# EAGLE design XY_RJ12_breakout (EAGLE 7.6.0)

## Sheet 1 of 2
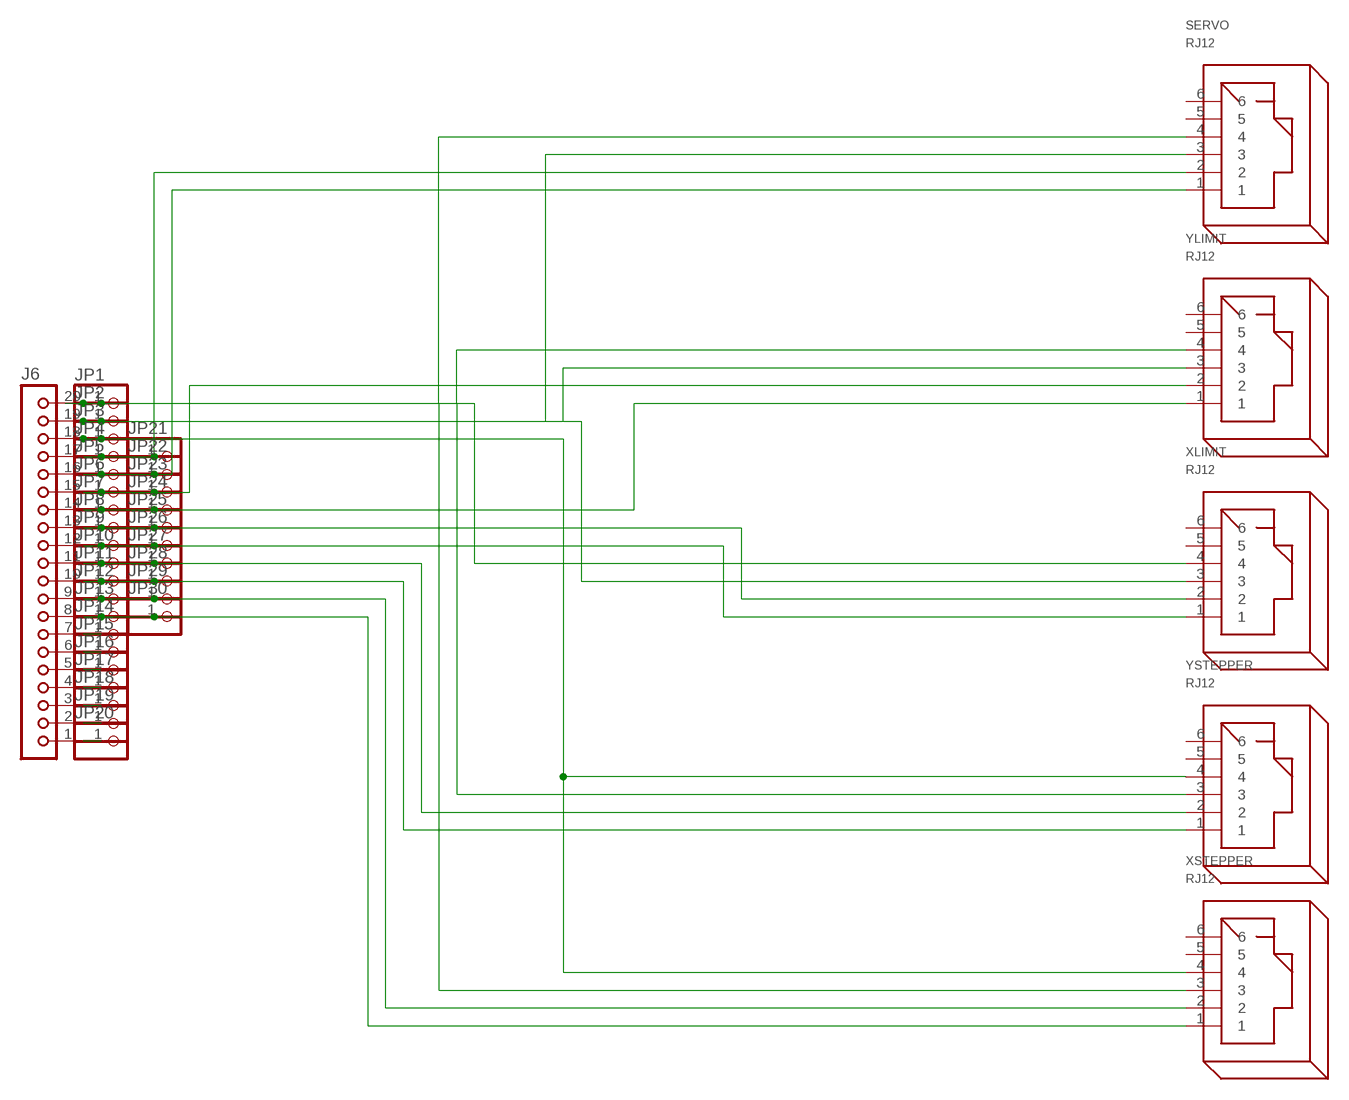
[diagram p0: schematic, sheet 1]

### Parts
J6  JBK20  [JBK20]
JP1  PINHD-1X1  [1X01]
JP2  PINHD-1X1  [1X01]
JP3  PINHD-1X1  [1X01]
JP4  PINHD-1X1  [1X01]
JP5  PINHD-1X1  [1X01]
JP6  PINHD-1X1  [1X01]
JP7  PINHD-1X1  [1X01]
JP8  PINHD-1X1  [1X01]
JP9  PINHD-1X1  [1X01]
JP10  PINHD-1X1  [1X01]
JP11  PINHD-1X1  [1X01]
JP12  PINHD-1X1  [1X01]
JP13  PINHD-1X1  [1X01]
JP14  PINHD-1X1  [1X01]
JP15  PINHD-1X1  [1X01]
JP16  PINHD-1X1  [1X01]
JP17  PINHD-1X1  [1X01]
JP18  PINHD-1X1  [1X01]
JP19  PINHD-1X1  [1X01]
JP20  PINHD-1X1  [1X01]
JP21  PINHD-1X1  [1X01]
JP22  PINHD-1X1  [1X01]
JP23  PINHD-1X1  [1X01]
JP24  PINHD-1X1  [1X01]
JP25  PINHD-1X1  [1X01]
JP26  PINHD-1X1  [1X01]
JP27  PINHD-1X1  [1X01]
JP28  PINHD-1X1  [1X01]
JP29  PINHD-1X1  [1X01]
JP30  PINHD-1X1  [1X01]
SERVO  RJ12  [RJ12]
XLIMIT  RJ12  [RJ12]
XSTEPPER  RJ12  [RJ12]
YLIMIT  RJ12  [RJ12]
YSTEPPER  RJ12  [RJ12]

### Nets
N$1: J6.20 JP1.1 SERVO.4 XLIMIT.4 XSTEPPER.3 YLIMIT.4 YSTEPPER.3
N$2: J6.19 JP2.1 SERVO.3 XLIMIT.3 YLIMIT.3
N$3: J6.18 JP3.1 XSTEPPER.4 YSTEPPER.4
N$4: J6.17 JP4.1 JP21.1 SERVO.2
N$5: J6.16 JP5.1 JP22.1 SERVO.1
N$6: J6.15 JP6.1 JP23.1 YLIMIT.2
N$7: J6.14 JP7.1 JP24.1 YLIMIT.1
N$8: J6.13 JP8.1 JP25.1 XLIMIT.2
N$9: J6.12 JP9.1 JP26.1 XLIMIT.1
N$10: J6.11 JP10.1 JP27.1 YSTEPPER.2
N$11: J6.10 JP11.1 JP28.1 YSTEPPER.1
N$12: J6.9 JP12.1 JP29.1 XSTEPPER.2
N$13: J6.8 JP13.1 JP30.1 XSTEPPER.1
N$14: J6.1 JP20.1
N$15: J6.2 JP19.1
N$16: J6.3 JP18.1
N$17: J6.4 JP17.1
N$18: J6.5 JP16.1
N$19: J6.6 JP15.1
N$20: J6.7 JP14.1
Unconnected: SERVO.5 SERVO.6 XLIMIT.5 XLIMIT.6 XSTEPPER.5 XSTEPPER.6 YLIMIT.5 YLIMIT.6 YSTEPPER.5 YSTEPPER.6

## Sheet 2 of 2

## Library data of the parts
J6 = con-lsta:JBK20: PIN HEADER; OC_FARNELL: unknown; OC_NEWARK: unknown
JP1-JP30 = pinhead:PINHD-1X1: PIN HEADER
SERVO XLIMIT XSTEPPER YLIMIT YSTEPPER = con-rj:RJ12: RJ12, RJ14 and RJ25 RJ12, RJ14 and RJ25 jacks side mounted http://www.tycoelectronics.com

## Board
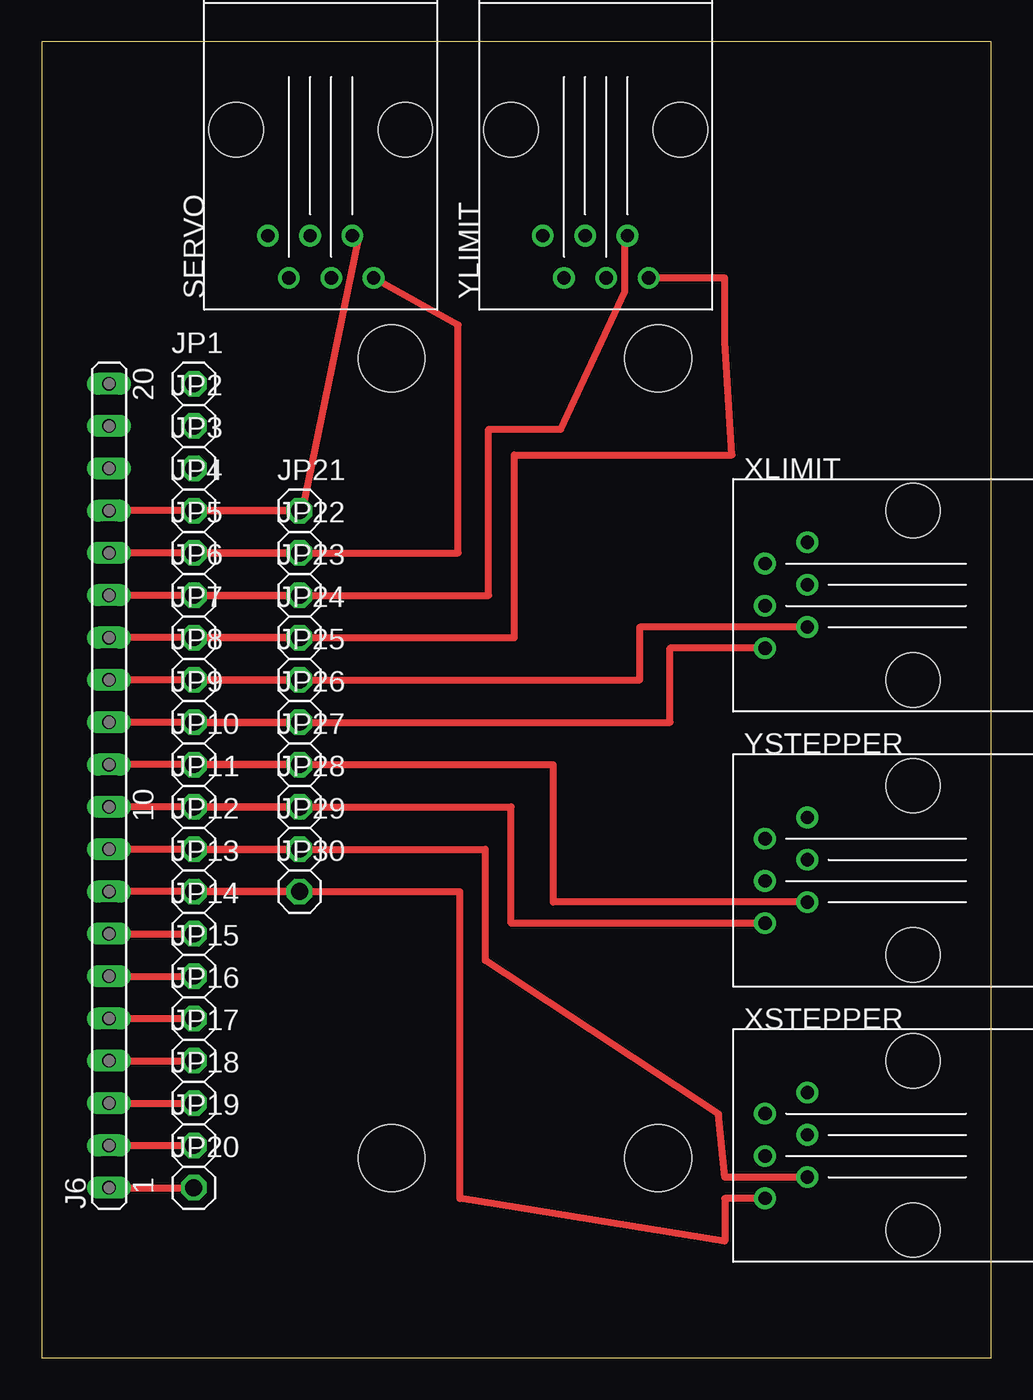
[diagram p1: board, top side]
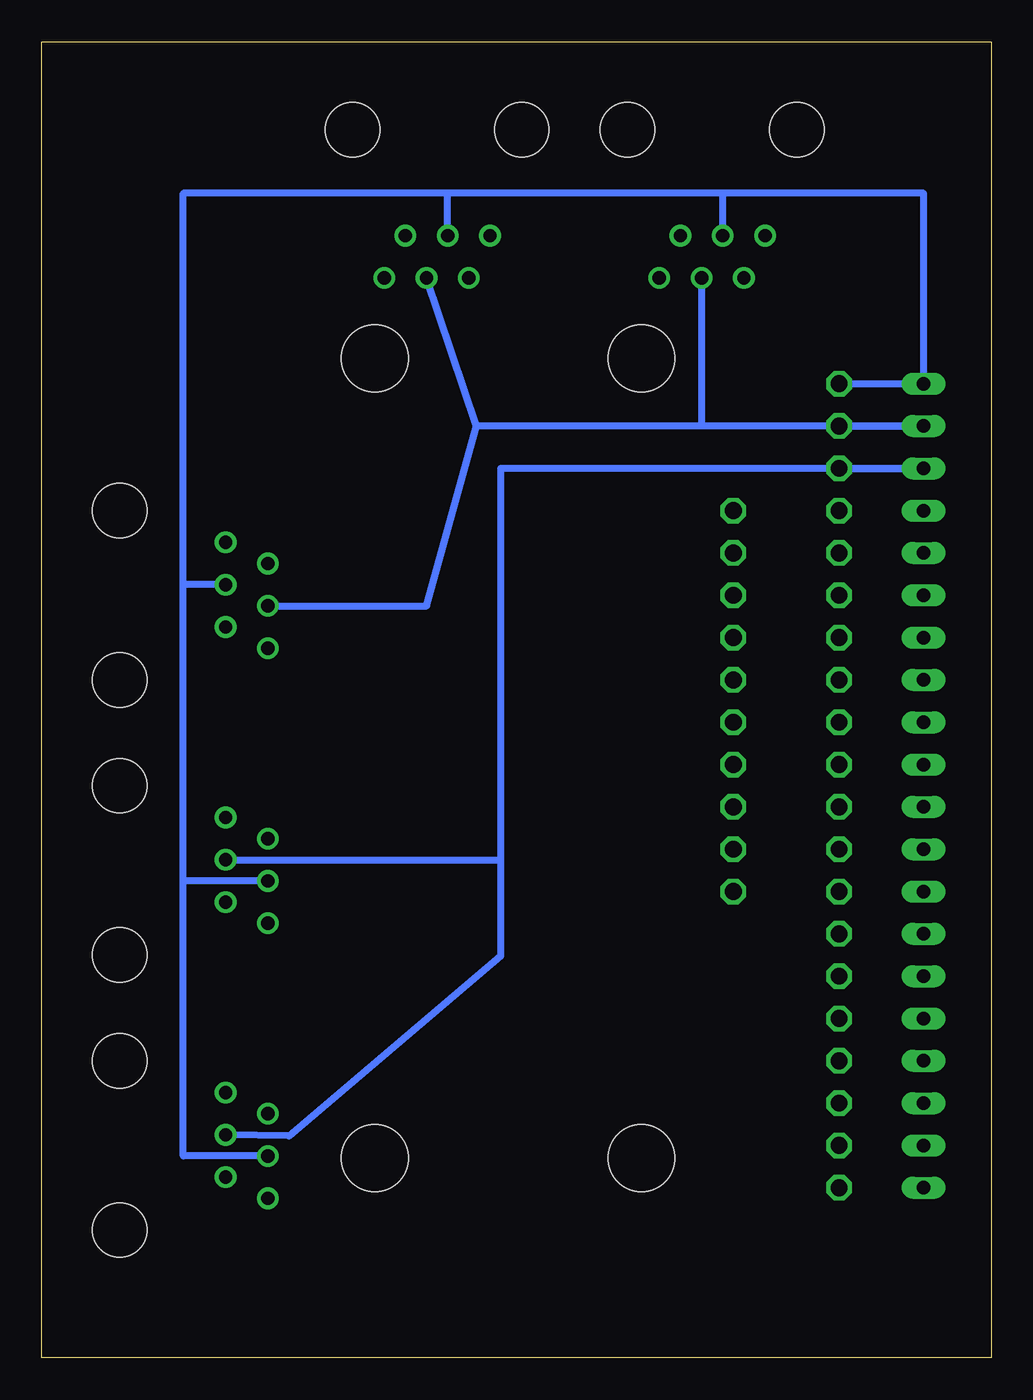
[diagram p2: board, bottom side, seen from below]

Size 57 x 79 mm. Coordinates in mm from the lower left corner, seen from the top.
Outline: 0,0 57,0 57,79 0,79 0,0
Copper layers (1*16): Top 0.035mm / dielectric 1.5mm / Bottom 0.035mm
Design rules "default": minimum track width 10mil, minimum drill 24mil, track to track 8mil, track to pad 8mil, pad to pad 8mil, via to via 8mil, smd to smd 8mil, copper to edge 40mil, drill to drill 8mil, minimum pad ring 10mil, minimum via ring 8mil, stop-mask expansion 4mil, vias tented up to drill 0mil, thermal gap 10mil
Holes 4 mm at 37,60 37,12 21,12 21,60

### Footprints (pad centres in the part's own frame; a part is rotated, then mirrored left to right if it is on the bottom)
JBK20 = drill 0.813 long: 1 -24.13,0; 2 -21.59,0; 3 -19.05,0; 4 -16.51,0; 5 -13.97,0; 6 -11.43,0; 7 -8.89,0; 8 -6.35,0; 9 -3.81,0; 10 -1.27,0; 11 1.27,0; 12 3.81,0; 13 6.35,0; 14 8.89,0; 15 11.43,0; 16 13.97,0; 17 16.51,0; 18 19.05,0; 19 21.59,0; 20 24.13,0
1X01 = drill 1.016 octagon: 1 0,0
RJ12 = drill 0.8: 1 -8.89,-3.175; 2 -6.35,-1.905; 3 -8.89,-0.635; 4 -6.35,0.635; 5 -8.89,1.905; 6 -6.35,3.175 | hole 3.25: 0,-5.08; 0,5.08

### Placement (x,y rotation side)
J6  4.05,34.34 90 top
JP1  9.13,58.47 0 top
JP2  9.13,55.93 0 top
JP3  9.13,53.39 0 top
JP4  9.13,50.85 0 top
JP5  9.13,48.31 0 top
JP6  9.13,45.77 0 top
JP7  9.13,43.23 0 top
JP8  9.13,40.69 0 top
JP9  9.13,38.15 0 top
JP10  9.13,35.61 0 top
JP11  9.13,33.07 0 top
JP12  9.13,30.53 0 top
JP13  9.13,27.99 0 top
JP14  9.13,25.45 0 top
JP15  9.13,22.91 0 top
JP16  9.13,20.37 0 top
JP17  9.13,17.83 0 top
JP18  9.13,15.29 0 top
JP19  9.13,12.75 0 top
JP20  9.13,10.21 0 top
JP21  15.48,50.85 0 top
JP22  15.48,48.31 0 top
JP23  15.48,45.77 0 top
JP24  15.48,43.23 0 top
JP25  15.48,40.69 0 top
JP26  15.48,38.15 0 top
JP27  15.48,35.61 0 top
JP28  15.48,33.07 0 top
JP29  15.48,30.53 0 top
JP30  15.48,27.99 0 top
SERVO  16.75,73.71 90 top
XLIMIT  52.31,45.77 0 top
XSTEPPER  52.31,12.75 0 top
YLIMIT  33.26,73.71 90 top
YSTEPPER  52.31,29.26 0 top

### Tracks (layer width: path | path; a pad name or v marks a point on that pad's centre or on a via)
N$1
  Bottom 0.406: 16.11,69.9 4.05,69.9 J6.20 JP1.1 | 16.11,69.9 32.62,69.9 | 32.62,69.9 48.5,69.9 48.5,46.41 | XLIMIT.4 48.5,46.41 | YLIMIT.4 32.62,69.9 | SERVO.4 16.11,69.9 | 48.5,28.62 48.5,12.11 XSTEPPER.3 | 48.5,28.62 48.5,46.41 | YSTEPPER.3 48.5,28.62
N$2
  Bottom 0.406: 17.38,55.93 J6.19 JP2.1 | 17.38,55.93 30.9,55.93 | 30.9,55.93 YLIMIT.3 | XLIMIT.3 33.9,45.14 30.9,55.93 | SERVO.3 17.38,55.93
N$3
  Bottom 0.406: 29.45,29.9 29.45,53.39 J6.18 JP3.1 | 29.45,29.9 29.45,24.12 42.15,13.32 XSTEPPER.4 | YSTEPPER.4 29.45,29.9
N$4
  Top 0.406: JP21.1 JP4.1 J6.17 JP21.1 | JP21.1 15.66,50.85 19,67 19,67.36 SERVO.2
N$5
  Top 0.406: JP22.1 JP5.1 J6.16 JP22.1 | JP22.1 25,48.31 25,62 SERVO.1
N$6
  Top 0.406: JP23.1 JP6.1 J6.15 JP23.1 | JP23.1 26.83,45.77 26.83,55.74 31.16,55.74 35,64 35,67.36 YLIMIT.2
N$7
  Top 0.406: JP24.1 JP7.1 J6.14 JP24.1 | JP24.1 28.37,43.23 28.37,54.2 41.44,54.2 41,61 41,64.82 YLIMIT.1
N$8
  Top 0.406: JP25.1 JP8.1 J6.13 JP25.1 | JP25.1 35.91,40.69 35.91,43.87 XLIMIT.2
N$9
  Top 0.406: JP26.1 JP9.1 J6.12 JP26.1 | JP26.1 37.72,38.15 37.72,42.59 XLIMIT.1
N$10
  Top 0.406: JP27.1 JP10.1 J6.11 JP27.1 | JP27.1 30.72,35.61 30.72,27.35 YSTEPPER.2
N$11
  Top 0.406: JP28.1 JP11.1 J6.10 JP28.1 | JP28.1 28.18,33.07 28.18,26.09 YSTEPPER.1
N$12
  Top 0.406: JP29.1 JP12.1 J6.9 JP29.1 | JP29.1 26.64,30.53 26.64,23.84 40.63,14.63 41,10.84 XSTEPPER.2
N$13
  Top 0.406: JP30.1 JP13.1 J6.8 JP30.1 | JP30.1 25.1,27.99 25.1,9.57 41,7 41,9.57 XSTEPPER.1
N$14
  Top 0.406: J6.1 JP20.1
N$15
  Top 0.406: J6.2 JP19.1
N$16
  Top 0.406: J6.3 JP18.1
N$17
  Top 0.406: J6.4 JP17.1
N$18
  Top 0.406: J6.5 JP16.1
N$19
  Top 0.406: J6.6 JP15.1
N$20
  Top 0.406: J6.7 JP14.1